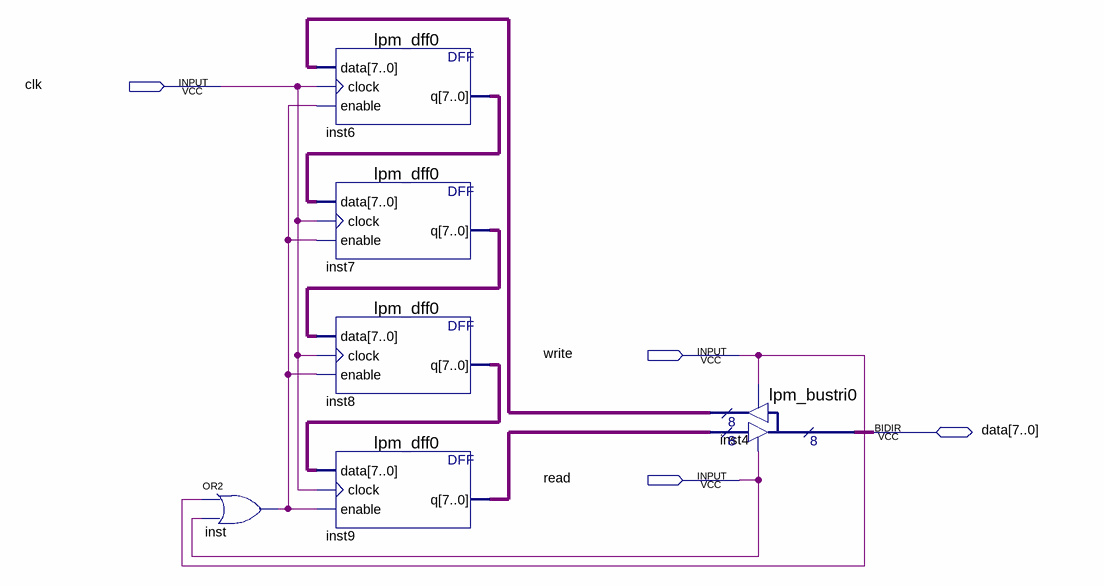
[diagram p0: schematic sheet]
// Quartus schematic buffer.bdf as structural Verilog: 6 symbols, 4 pins
module buffer (
  input  clk,
  input  write,
  input  read,
  inout  [7:0] data
);

  wire inst_out;
  wire [7:0] inst4_result, inst6_q, inst7_q, inst8_q, inst9_q;

  or inst (inst_out, write, read);
  lpm_dff0 inst6 (.data(inst4_result), .clock(clk), .enable(inst_out), .q(inst6_q));
  lpm_dff0 inst7 (.data(inst6_q), .clock(clk), .enable(inst_out), .q(inst7_q));
  lpm_dff0 inst8 (.data(inst7_q), .clock(clk), .enable(inst_out), .q(inst8_q));
  lpm_dff0 inst9 (.data(inst8_q), .clock(clk), .enable(inst_out), .q(inst9_q));
  lpm_bustri0 inst4 (.enabledt(read), .data(inst9_q), .enabletr(write), .result(inst4_result), .tridata(data));
endmodule
